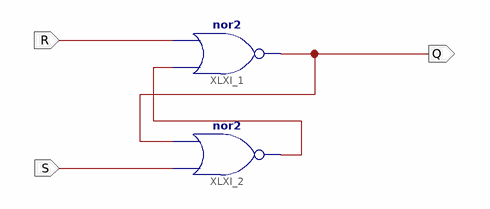
[diagram p0: schematic sheet 1]
// Xilinx ISE schematic rs_nor.sch (spartan6) as structural Verilog: 2 symbols, 3 ports
module rs_nor (
  input  R,
  input  S,
  output Q
);

  wire XLXN_3;

  nor XLXI_1 (Q, XLXN_3, R);
  nor XLXI_2 (XLXN_3, S, Q);
endmodule
